# EAGLE design Xbee_shield_v1.11 (EAGLE 5.06)
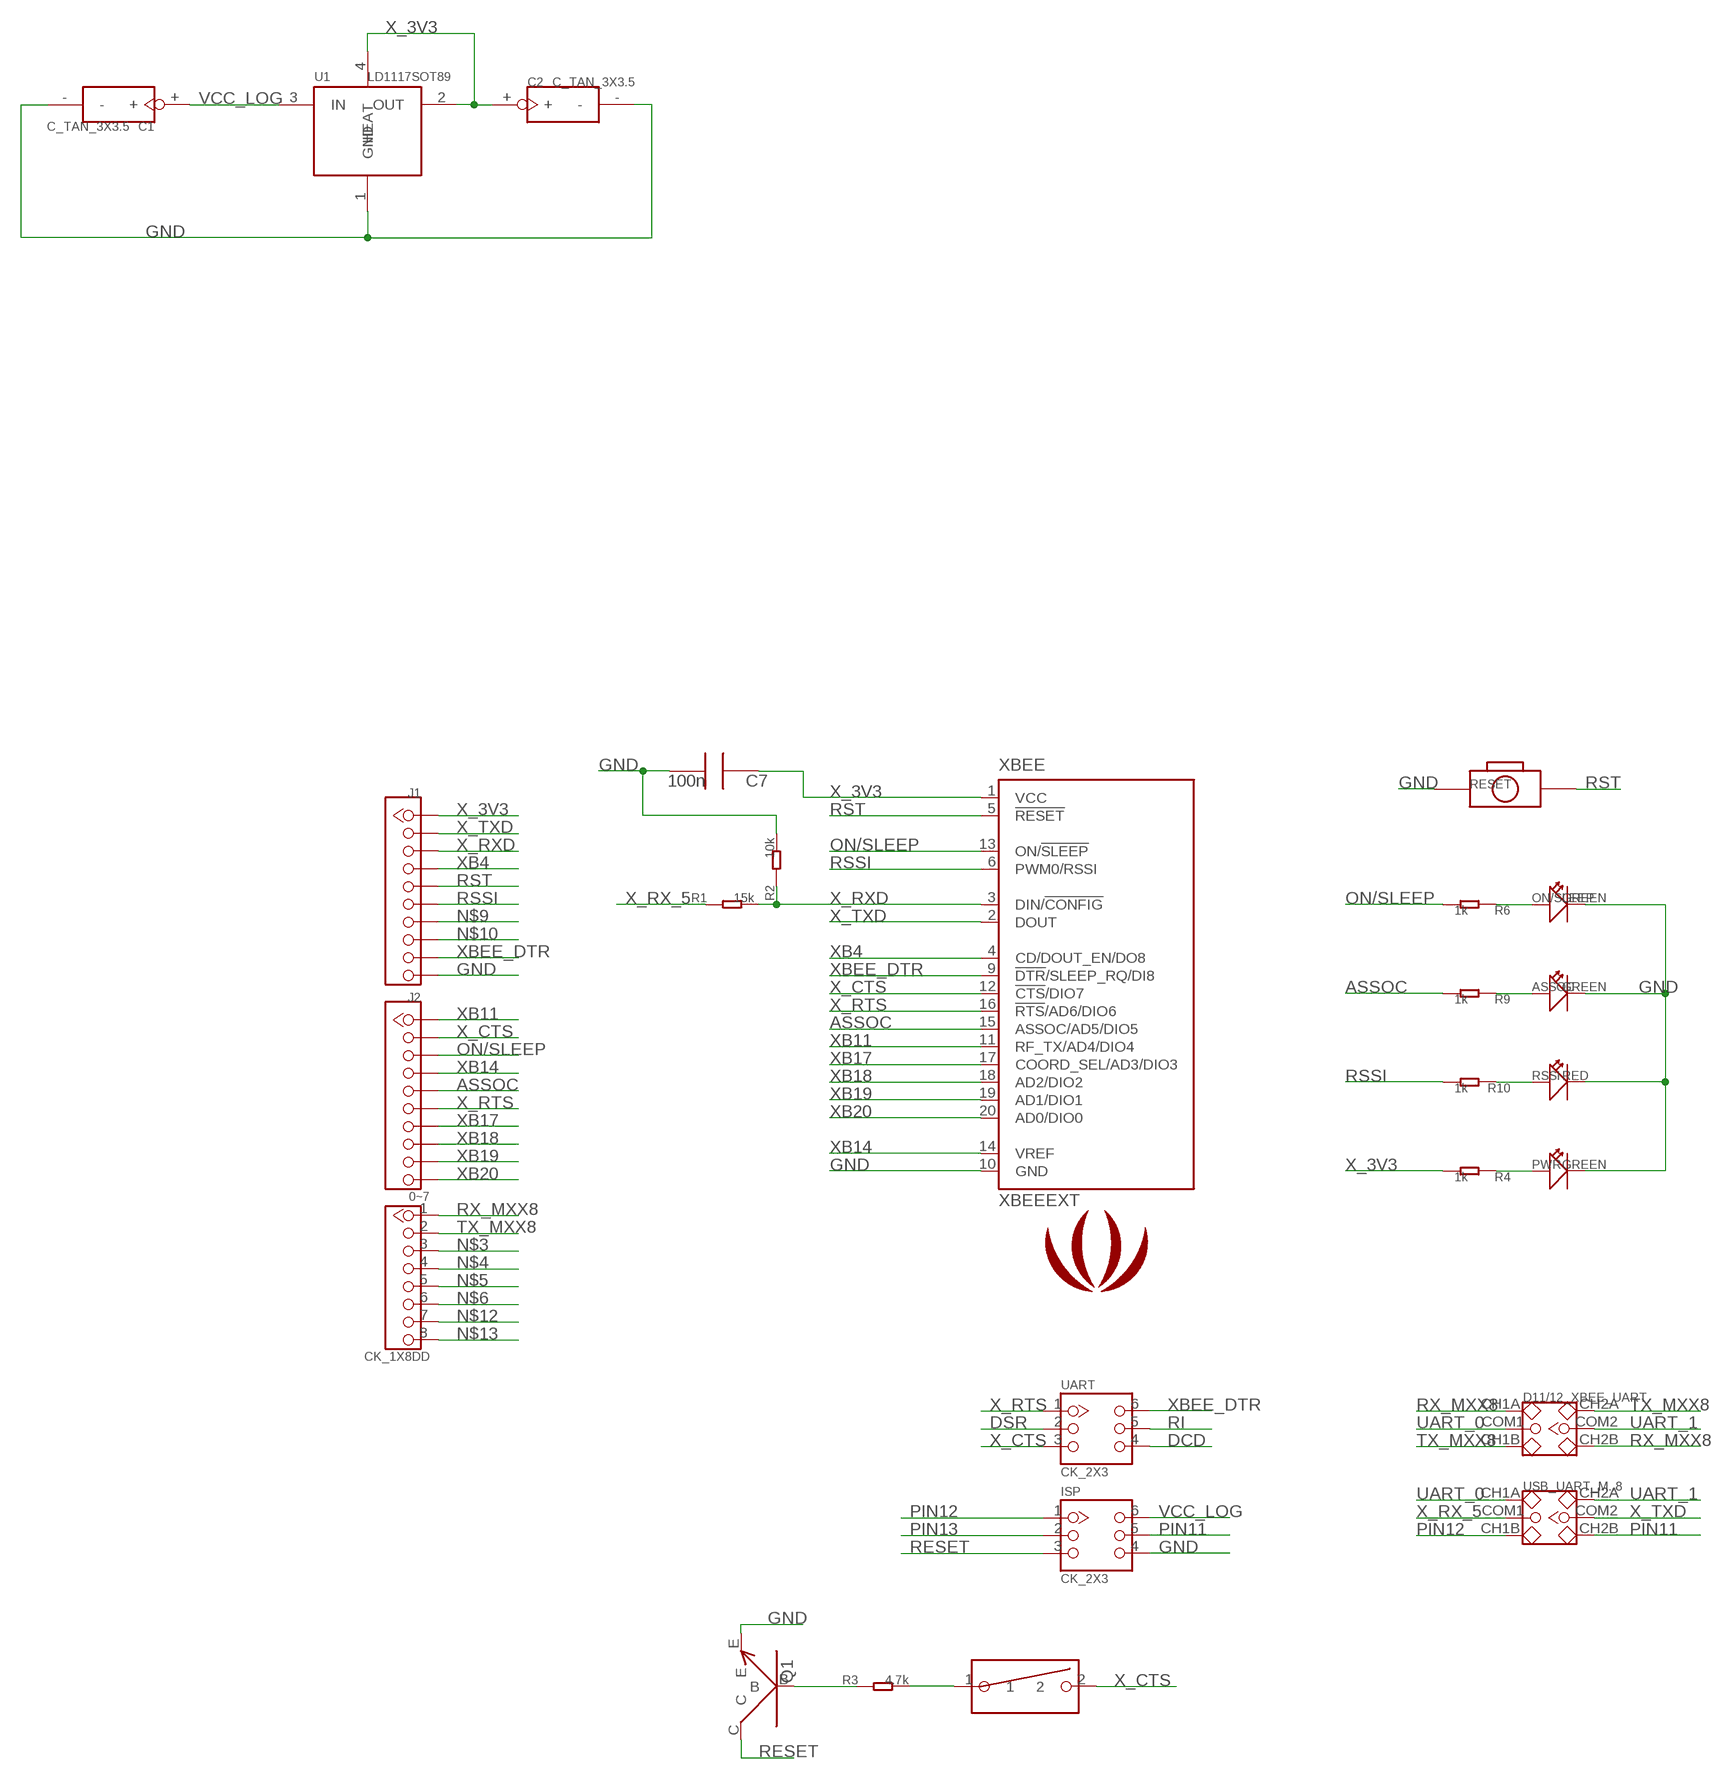
[diagram p0: schematic, sheet 1]

## Parts
0~7  CK_1X8DD  [CK_1X8]
ASSOC  GREEN  LED0603  [LED0603]
C1  C_TAN_3X3.5  [C_TAN_3X3.5]
C2  C_TAN_3X3.5  [C_TAN_3X3.5]
C7  100n  C0603  [0603]
D11/12_XBEE_UART  2.54SW_2CH  [2.54SW_2CH]
ISP  CK_2X3  [CK_2X3_THIN]
J1  CK1X10DD  [CK1X10]
J2  CK1X10DD  [CK1X10]
JP1  SMD_JP  [JP]
LOGO1  LOGO_COPPER200X166  [LOGO_COPPER]
ON/SLEEP  GREEN  LED0603  [LED0603]
PWR  GREEN  LED0603  [LED0603]
Q1  NPN_9013  [SOT23]
R1  15k  R0603  [0603]
R2  10k  R0603  [0603]
R3  4.7k  R0603  [0603]
R4  1k  R0603  [0603]
R6  1k  R0603  [0603]
R9  1k  R0603  [0603]
R10  1k  R0603  [0603]
RESET  BOTTON_1  BOTTON_1_DP  [BTN_5.0_RST]
RSSI  RED  LED0603  [LED0603]
U1  LD1117SOT89  [SOT89]
UART  CK_2X3  [CK_2X3_THIN]
USB_UART_M..8  2.54SW_2CH  [2.54SW_2CH]
XBEE  XBEEEXT  [XBEE_PLUG]

## Nets
ASSOC: J2.5 R9.2 XBEE.15(ASSOC/AD5/DIO5)
DCD: UART.4
DSR: UART.2
GND: ASSOC.2(-) C1.- C2.- C7.2 ISP.4 J1.10 ON/SLEEP.2(-) PWR.2(-) Q1.E R2.2 RESET.P$1 RSSI.2(-) U1.1(GND) XBEE.10(GND)
N$1: Q1.B R3.1
N$2: JP1.1 R3.2
N$3: 0~7.3
N$4: 0~7.4
N$5: 0~7.5
N$6: 0~7.6
N$7: ON/SLEEP.1(+) R6.1
N$8: ASSOC.1(+) R9.1
N$9: J1.7
N$10: J1.8
N$11: R10.1 RSSI.1(+)
N$12: 0~7.7
N$13: 0~7.8
N$14: PWR.1(+) R4.1
ON/SLEEP: J2.3 R6.2 XBEE.13(ON/!SLEEP)
PIN11: ISP.5 USB_UART_M..8.CH2B
PIN12: ISP.1 USB_UART_M..8.CH1B
PIN13: ISP.2
RESET: ISP.3 Q1.C
RI: UART.5
RSSI: J1.6 R10.2 XBEE.6(PWM0/RSSI)
RST: J1.5 RESET.P$2 XBEE.5(!RESET)
RX_MXX8: 0~7.1 D11/12_XBEE_UART.CH1A D11/12_XBEE_UART.CH2B
TX_MXX8: 0~7.2 D11/12_XBEE_UART.CH1B D11/12_XBEE_UART.CH2A
UART_0: D11/12_XBEE_UART.COM1 USB_UART_M..8.CH1A
UART_1: D11/12_XBEE_UART.COM2 USB_UART_M..8.CH2A
VCC_LOG: C1.+ ISP.6 U1.3(IN)
X_3V3: C2.+ C7.1 J1.1 R4.2 U1.2(OUT) U1.4(HEAT) XBEE.1(VCC)
X_CTS: J2.2 JP1.2 UART.3 XBEE.12(!CTS!/DIO7)
X_RTS: J2.6 UART.1 XBEE.16(!RTS!/AD6/DIO6)
X_RX_5: R1.1 USB_UART_M..8.COM1
X_RXD: J1.3 R1.2 R2.1 XBEE.3(DIN/!CONFIG)
X_TXD: J1.2 USB_UART_M..8.COM2 XBEE.2(DOUT)
XB4: J1.4 XBEE.4(CD/DOUT_EN/DO8)
XB11: J2.1 XBEE.11(RF_TX/AD4/DIO4)
XB14: J2.4 XBEE.14(VREF)
XB17: J2.7 XBEE.17(COORD_SEL/AD3/DIO3)
XB18: J2.8 XBEE.18(AD2/DIO2)
XB19: J2.9 XBEE.19(AD1/DIO1)
XB20: J2.10 XBEE.20(AD0/DIO0)
XBEE_DTR: J1.9 UART.6 XBEE.9(!DTR!/SLEEP_RQ/DI8)

## Library data of the parts
0~7 = CONNECTER:CK_1X8
ASSOC ON/SLEEP PWR RSSI = CPT_SMD:LED0603
C1 C2 = CPT_SMD:C_TAN
C7 = CPT_SMD:C0603; C0603: 100N
D11/12_XBEE_UART USB_UART_M..8 = CPT_CJ:2.54SW_2CH
ISP UART = CONNECTER:CK_2X3
J1 J2 = CONNECTER:CK1X10
JP1 = CPT_SMD:SMD_JP
LOGO1 = logo:LOGO_COPPER
Q1 = CPT_SMD:NPN_9013
R1-R4 R6 R9 R10 = CPT_SMD:R0603
RESET = CPT_SMD:BOTTON_1
U1 = ICs_v54:LD1117
XBEE = EXT_moudle:XBEE: XBee (TM) /XBee-PRO(TM) OEM RF Modules Source: MaxStream, Inc. xbee_productmanual.pdf

## Net classes
1 power: width 0.61 mm

## Board
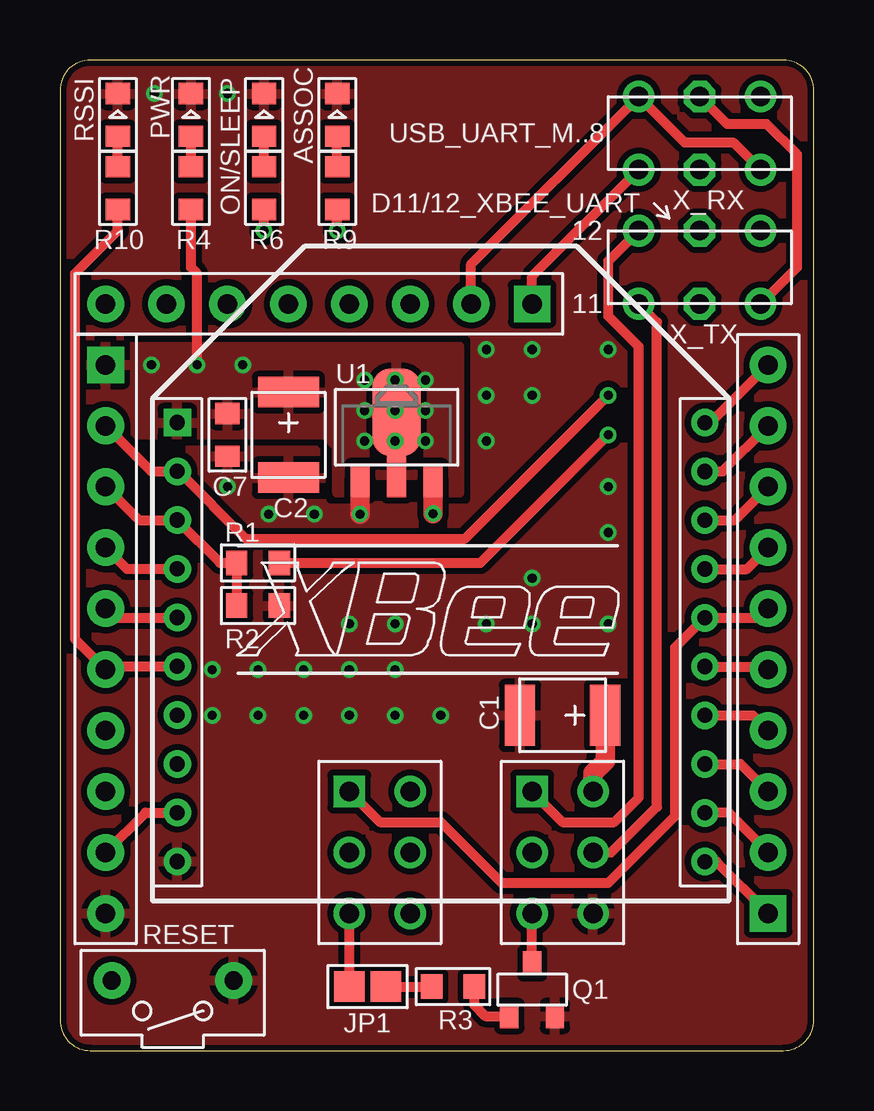
[diagram p1: board, top side]
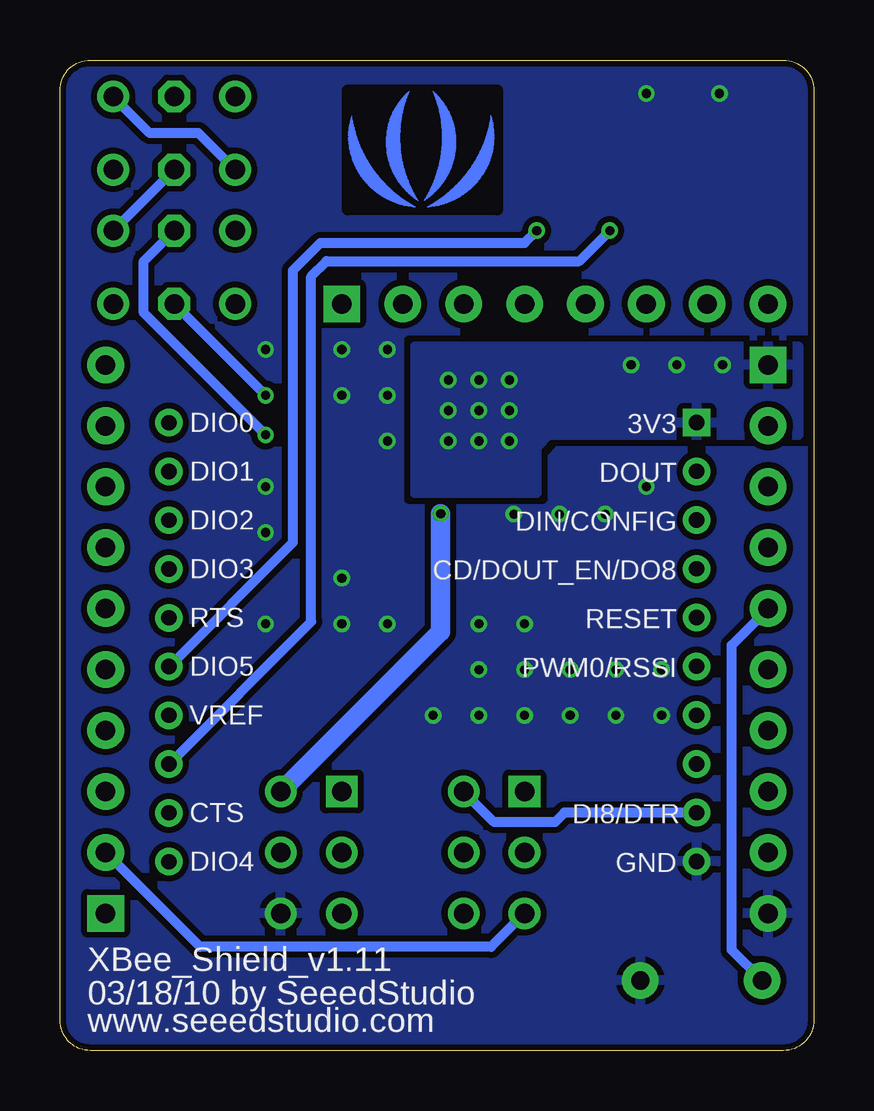
[diagram p2: board, bottom side, seen from below]

Size 31.43 x 41.27 mm. Coordinates in mm from the lower left corner, seen from the top.
Outline: 31.43,40.01 arc90 30.16,41.27 1.27,41.27 arc90 0,40.01 0,1.27 arc90 1.27,0 30.16,0 arc90 31.43,1.27 31.43,40.01
Copper layers (1*16): Top 0.035mm / dielectric 1.5mm / Bottom 0.035mm
Design rules "rule_manufacture": minimum track width 8mil, minimum drill 12mil, track to track 8mil, track to pad 8mil, pad to pad 6mil, via to via 10mil, smd to smd 0mil, copper to edge 10mil, drill to drill 10mil, minimum pad ring 10mil, minimum via ring 6mil, stop-mask expansion 2mil, vias tented up to drill 25mil, thermal gap 10mil
bRestrict: area 13.2,35.1 to 19.4,40

### Footprints (pad centres in the part's own frame; a part is rotated, then mirrored left to right if it is on the bottom)
CK_1X8 = drill 0.813 pad 1.524 square: 1 0,8.89 | drill 0.813 pad 1.524 round: 2 0,6.35; 3 0,3.81; 4 0,1.27; 5 0,-1.27; 6 0,-3.81; 7 0,-6.35; 8 0,-8.89
LED0603 = smd 0.889 x 1.016: 1 -0.889,0; 2 0.889,0
C_TAN_3X3.5 = smd 2.54 x 1.27: + 0,1.778; - 0,-1.778
0603 = smd 0.889 x 1.016: 1 -0.889,0; 2 0.889,0
2.54SW_2CH = drill 0.813 pad 1.27 round: CH1A -1.524,2.54; CH1B -1.524,-2.54; CH2A 1.524,2.54; CH2B 1.524,-2.54 | drill 0.813 pad 1.27 octagon: COM1 -1.524,0; COM2 1.524,0
CK_2X3_THIN = drill 0.813 pad 1.27 square: 1 -1.27,2.54 | drill 0.813 pad 1.27 round: 2 -1.27,0; 3 -1.27,-2.54; 4 1.27,-2.54; 5 1.27,0; 6 1.27,2.54
CK1X10 = drill 0.813 pad 1.524 square: 1 0,11.43 | drill 0.813 pad 1.524 round: 2 0,8.89; 3 0,6.35; 4 0,3.81; 5 0,1.27; 6 0,-1.27; 7 0,-3.81; 8 0,-6.35; 9 0,-8.89; 10 0,-11.43
JP = smd 1.27 x 1.27: 1 -0.762,0; 2 0.762,0
SOT23 = smd 0.762 x 1.016: B -0.95,-1.1; C 0,1.1; E 0.95,-1.1
BTN_5.0_RST = drill 0.762 pad 1.524 round: P$1 0,2.54; P$2 0,-2.54
SOT89 = smd 0.8 x 1.4: 1 -1.524,-1.905; 3 1.524,-1.905 | smd 0.8 x 1.9: 2 0,-1.651 | smd 2.032 x 3.65: 4 0,0.94
XBEE_PLUG = drill 0.635 pad 1.016 square: 1 0,0.008 | drill 0.635 pad 1.016 round: 2 0,-2.024; 3 0,-4.056; 4 0,-6.088; 5 0,-8.12; 6 0,-10.152; 7 0,-12.184; 8 0,-14.216; 9 0,-16.248; 10 0,-18.28; 11 21.996,-18.288; 12 21.996,-16.256; 13 21.996,-14.224; 14 21.996,-12.192; 15 21.996,-10.16; 16 21.996,-8.128; 17 21.996,-6.096; 18 21.996,-4.064; 19 21.996,-2.032; 20 21.996,0

### Placement (x,y rotation side)
0~7  10.79,31.11 270 top
ASSOC  11.56,38.99 90 top
C1  20.95,13.97 270 top
C2  9.53,25.65 0 top
C7  6.99,25.65 270 top
D11/12_XBEE_UART  26.67,38.23 90 top
ISP  20.95,8.26 0 top
J1  1.91,17.14 0 top
J2  29.53,17.14 180 top
JP1  12.83,2.67 180 top
LOGO1  16.38,36.83 0 bottom
ON/SLEEP  8.51,38.99 90 top
PWR  5.46,38.99 90 top
Q1  19.68,2.54 0 top
R1  8.26,20.32 180 top
R2  8.26,18.54 0 top
R3  16.38,2.67 180 top
R4  5.46,35.94 270 top
R6  8.51,35.94 270 top
R9  11.56,35.94 270 top
R10  2.41,35.94 270 top
RESET  4.7,2.92 270 top
RSSI  2.41,38.99 90 top
U1  14.03,25.65 0 top
UART  13.34,8.26 0 top
USB_UART_M..8  26.67,32.64 270 top
XBEE  4.89,26.16 0 top

### Tracks (layer width: path | path; a pad name or v marks a point on that pad's centre or on a via)
ASSOC  (via drill 0.38)
  Top 0.406: XBEE.15 29.4,16 J2.5 | v11.56,34.16 R9.2
  Bottom 0.406: XBEE.15 21.72,21.17 21.72,32.51 20.57,33.66 12.06,33.66 v11.56,34.16
GND  (via drill 0.38)
  Top 0.813: v12.51,22.35 U1.1
  other vias: 6.99,39.88 3.94,39.88 22.86,29.21 17.78,29.21 19.68,29.21 19.68,27.3 17.78,27.3 17.78,25.4 22.86,23.5 22.86,21.59 10.6,22.35 8.7,22.35 6.99,23.5 22.86,17.78 17.78,17.78 19.68,17.78 19.68,19.68 13.97,17.78 12.06,17.78 12.06,15.88 13.97,15.88 13.97,13.97 15.88,13.97 12.06,13.97 10.16,13.97 10.16,15.88 8.26,15.88 6.35,15.88 6.35,13.97 8.26,13.97
  pour Top: -10.79,40.01 -8.89,40.01 -8.89,38.73 -10.79,38.73
  pour Bottom (isolate 0.254, rank 6): 1.27,0 arc-90 0,1.27 0,40.01 arc-90 1.27,41.27 30.16,41.27 arc-90 31.43,40.01 31.43,1.27 arc-90 30.16,0
  pour Top (isolate 0.254, rank 6): 1.27,0 arc-90 0,1.27 0,40.01 arc-90 1.27,41.27 30.16,41.27 arc-90 31.43,40.01 31.43,1.27 arc-90 30.16,0
N$1
  Top 0.406: Q1.B 17.74,1.44 17.27,1.91 R3.1
N$2
  Top 0.406: JP1.1 R3.2
N$7
  Top 0.406: R6.1 ON/SLEEP.1
N$8
  Top 0.406: R9.1 ASSOC.1
N$11
  Top 0.406: R10.1 RSSI.1
N$14
  Top 0.406: R4.1 PWR.1
ON/SLEEP  (via drill 0.38)
  Top 0.406: XBEE.13 28.38,11.94 J2.3 | v8.51,34.16 R6.2
  Bottom 0.406: XBEE.13 20.95,17.87 20.95,32.26 20.32,32.89 9.78,32.89 v8.51,34.16
PIN11
  Top 0.406: ISP.5 22.99,8.26 24.89,10.16 24.89,30.35 USB_UART_M..8.CH2B
PIN12
  Top 0.406: ISP.1 20.95,9.53 23.11,9.53 24.13,10.54 24.13,29.34 22.86,30.61 22.86,32.89 USB_UART_M..8.CH1B
RESET
  Top 0.406: Q1.C ISP.3
RSSI
  Top 0.406: XBEE.6 2.04,16.01 J1.6 0.64,17.14 0.64,32.38 2.41,34.16 R10.2
RST
  Top 0.406: XBEE.5 2.28,18.04 J1.5
  Bottom 0.406: RESET.P$2 3.43,4.19 3.43,16.89 J1.5
RX_MXX8
  Top 0.406: 0~7.1 19.68,32.26 D11/12_XBEE_UART.CH1A
  Bottom 0.406: D11/12_XBEE_UART.CH1A 25.65,38.23 27.69,38.23 D11/12_XBEE_UART.CH2B
TX_MXX8
  Top 0.406: D11/12_XBEE_UART.CH1B 28.07,37.85 26.04,37.85 D11/12_XBEE_UART.CH2A 17.14,32.77 0~7.2
UART_0
  Bottom 0.406: USB_UART_M..8.CH1A D11/12_XBEE_UART.COM1
UART_1
  Top 0.406: USB_UART_M..8.CH2A 30.73,32.64 30.73,37.34 29.46,38.61 27.81,38.61 D11/12_XBEE_UART.COM2
VCC_LOG  (via drill 0.38)
  Top 0.813: ISP.6 22.23,11.56 22.73,12.06 C1.+ | v15.56,22.38 U1.3
  Bottom 0.813: ISP.6 15.56,17.46 v15.56,22.38
X_3V3  (via drill 0.38)
  Top 0.406: R4.2 5.46,32.64 5.71,32.38 v5.71,28.57
  other vias: 3.81,28.57 7.62,28.57 13.97,27.94 13.97,26.67 13.97,25.4 12.7,26.67 15.24,26.67 12.7,27.94 15.24,27.94 12.7,25.4 15.24,25.4
  pour Bottom (isolate 0.254): 0.64,29.34 16.64,29.34 16.64,23.24 11.56,23.24 11.56,25.14 11.05,25.65 0.64,25.65
  pour Top (isolate 0.254): 0.64,29.34 16.64,29.34 16.64,23.24 11.56,23.24 11.56,25.14 11.05,25.65 0.64,25.65
X_CTS
  Top 0.406: XBEE.12 27.88,9.91 J2.2 | JP1.2 UART.3
  Bottom 0.406: UART.3 13.46,4.32 25.59,4.32 J2.2
X_RTS
  Top 0.406: J2.6 29.15,18.03 XBEE.16 25.65,16.8 25.65,9.78 22.86,6.99 18.41,6.99 15.88,9.53 13.34,9.53 UART.1
X_RX_5  (via drill 0.38)
  Top 0.406: R1.1 17.53,20.32 v22.86,25.65
  Bottom 0.406: v22.86,25.65 27.94,30.73 27.94,32.89 USB_UART_M..8.COM1
X_RXD
  Top 0.406: J1.3 3.29,22.11 XBEE.3 6.67,20.32 R1.2 R2.1
X_TXD  (via drill 0.38)
  Top 0.406: J1.2 3.8,24.14 XBEE.2 4.95,24.14 7.75,21.34 16.89,21.34 v22.86,27.3
  Bottom 0.406: v22.86,27.3 USB_UART_M..8.COM2
XB4
  Top 0.406: XBEE.4 2.79,20.07 J1.4
XB11
  Top 0.406: XBEE.11 27.37,7.87 J2.1
XB14
  Top 0.406: XBEE.14 28.89,13.97 J2.4
XB17
  Top 0.406: XBEE.17 28.64,20.07 J2.7
XB18
  Top 0.406: XBEE.18 28.13,22.1 J2.8
XB19
  Top 0.406: XBEE.19 27.62,24.13 J2.9
XB20
  Top 0.406: XBEE.20 27.11,26.16 J2.10
XBEE_DTR
  Top 0.406: XBEE.9 3.56,9.91 J1.9
  Bottom 0.406: XBEE.9 10.41,9.91 10.79,9.53 13.34,9.53 UART.6

### Text on the board
Top: top layer
Bottom: bottom layer
Dimension: boardoutline
tPlace: silktop | X_RX | 12 | 11 | X_TX
bPlace: silkbottom | 3V3 | DIO0 | DOUT | DIO1 | DIN/CONFIG | DIO2 | CD/DOUT_EN/DO8 | DIO3 | RESET | RTS | PWM0/RSSI | DIO5 | VREF | DI8/DTR | CTS | GND | DIO4 | XBee_Shield_v1.11 | 03/18/10 by SeeedStudio | www.seeedstudio.com
tStop: soldermask top
bStop: soldermask bottom
tCream: padmask top
bCream: padmask bottom
Drills: drill